# EAGLE schematic Janus (EAGLE 7.3.0)
AUTHOR: Jordan Jones; AUTHOR1: Gabriel Maraboto; DESCRIPT: Single Two Input XOR Single One Input NOT 555 Timer Quad Two Input AND; DEVICE: CAPACITOR CAPACITOR 1N4148X-TP TLP152 TLP152 TLP152 DMN6140L-7 DMN6140L-7 RESISTOR RESISTOR RESISTOR RESISTOR 74LVC1G86W5-7 74HCT1G14GW,125 NE555S-13DICT-ND SN74LV08APWR; DOCNUM: 1; ORGANIZATION: CAL POLY IGVC; PACKAGE: C0603 C0603 SOD523_SC79 SOIC-6-5 SOIC-6-5 SOIC-6-5 SOT-23 SOT-23 R0603 R0603 R0603 R0603 SOT-25 SOT-353 SO-8 TSSOP-14; PARTS: C1 C2 D1 OK1 OK2 OK3 Q1 Q2 R1 R2 R3 R4 U1 U2 U3 U4; PARTVAL: .01uF 100nF 330ohm 330ohm 330ohm 1Mohm; REV: 1.0.1
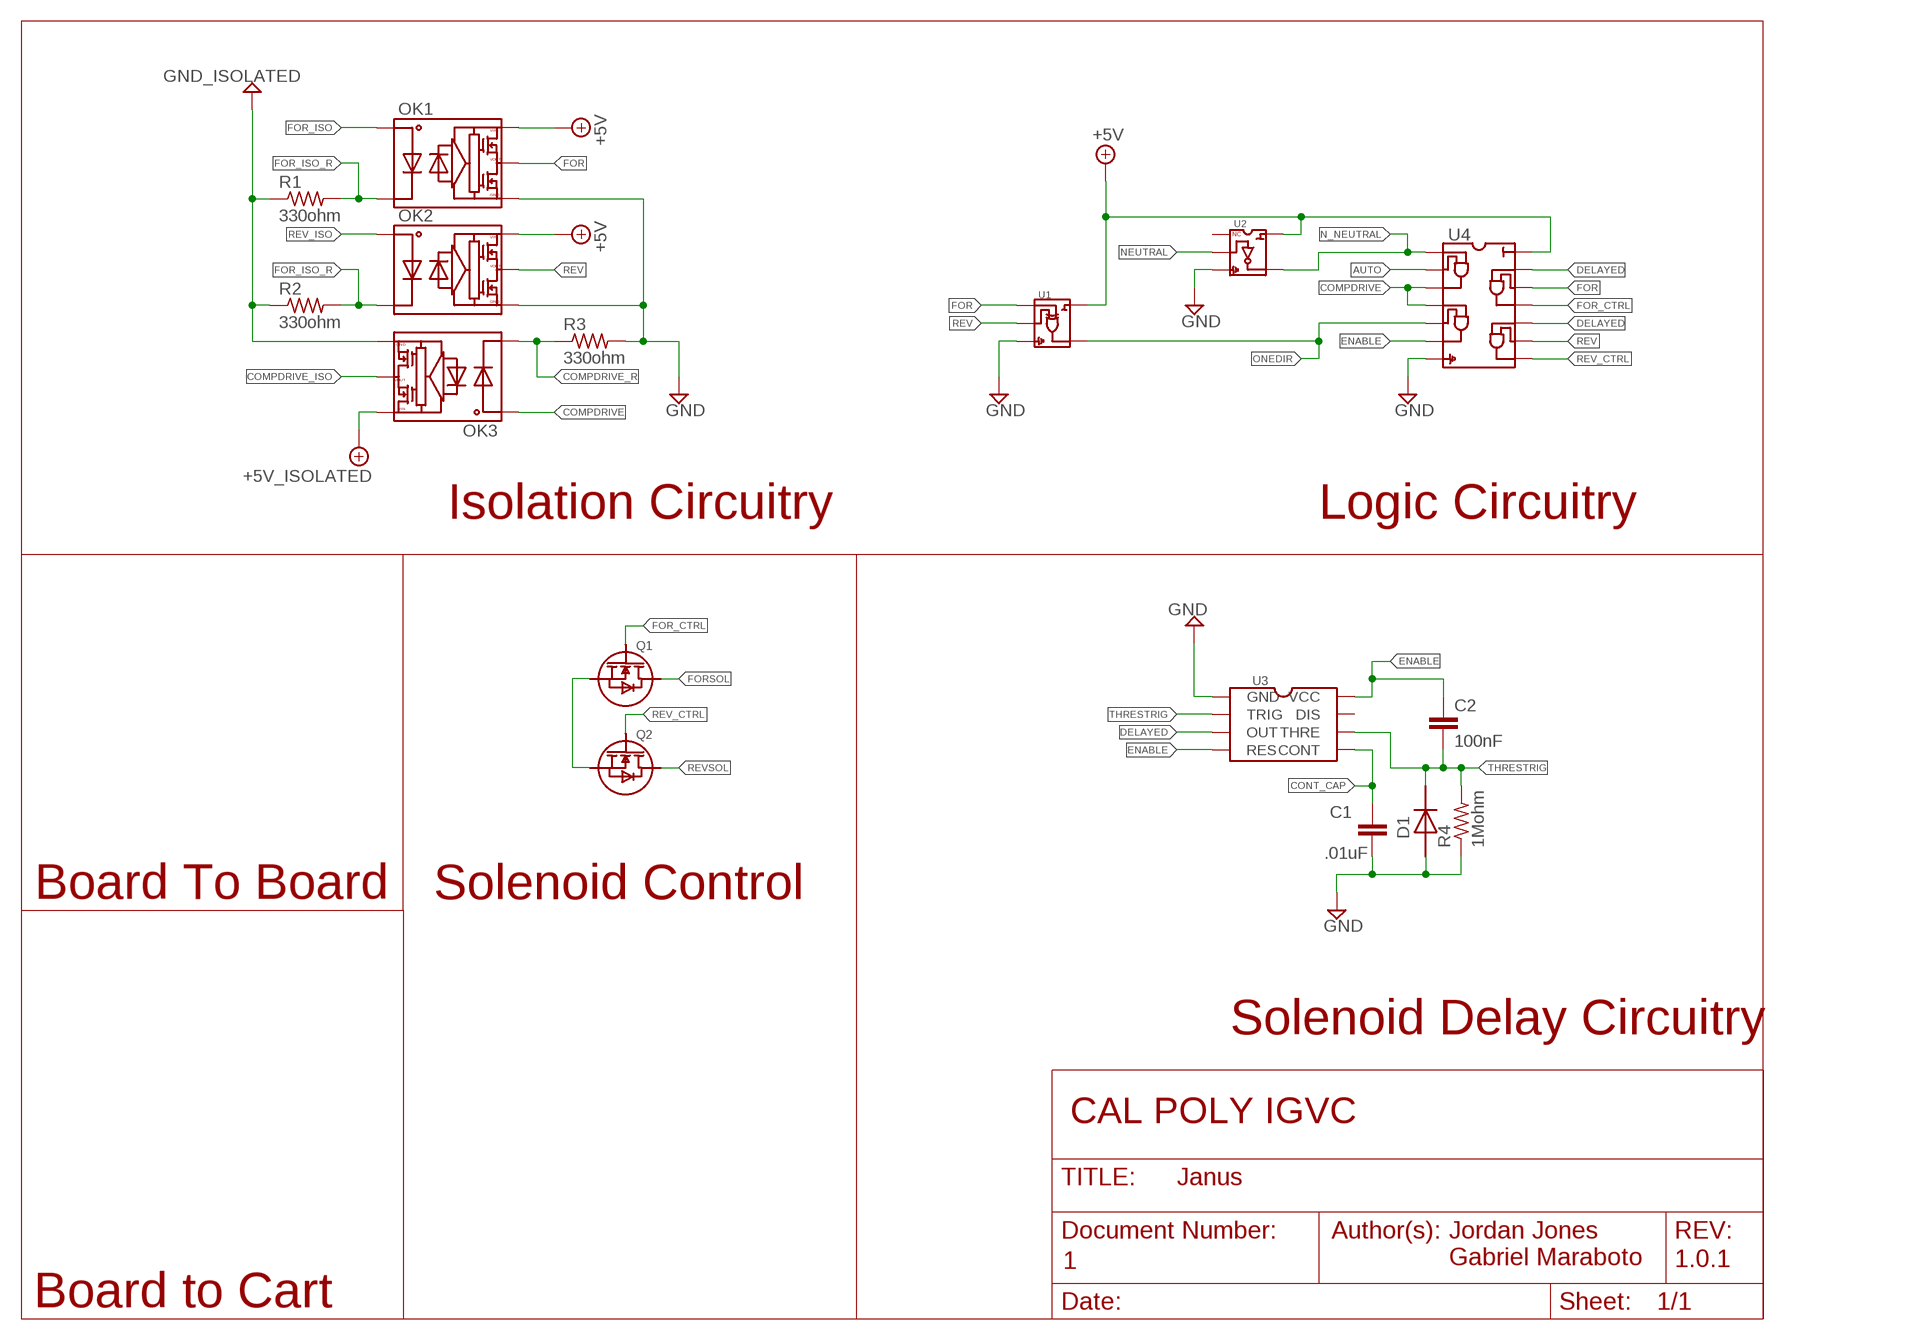
[diagram p0: schematic, sheet 1]

## Parts
C1  .01uF  C-EUC0603  [C0603]
C2  100nF  C-EUC0603  [C0603]
D1  1N4148X-TP  [SOD523_SC79]
OK1  TLP152  [6-SOIC-5]
OK2  TLP152  [6-SOIC-5]
OK3  TLP152  [6-SOIC-5]
Q1  DMN6140L-7  [SOT23]
Q2  DMN6140L-7  [SOT23]
R1  330ohm  R-US_R0603  [R0603]
R2  330ohm  R-US_R0603  [R0603]
R3  330ohm  R-US_R0603  [R0603]
R4  1Mohm  R-US_R0603  [R0603]
U1  74LVC1G86W5-7  [SOT-25]
U2  74HCT1G14GW,125  [SOT-353]
U3  NE555S-13DICT-ND  [SO-8]
U4  SN74LV08APWR  [TSSOP-14]

## Nets
+5V: OK1.P$6 OK2.P$6 OK3.P$6 U1.P$5 U2.P$5 U4.P$14 ; supply symbol labelled +5V_ISOLATED
AUTO: U4.P$2
COMPDRIVE: OK3.P$1 U4.P$3 U4.P$4
COMPDRIVE_ISO: OK3.P$5
COMPDRIVE_R: OK3.P$3 R3.1
CONT_CAP: C1.1 U3.P$5(CONT)
DELAYED: U3.P$3(OUT) U4.P$10 U4.P$13
ENABLE: C2.1 U3.P$4(RES) U3.P$8(VCC) U4.P$6
FOR: OK1.P$5 U1.P$1 U4.P$12
FOR_CTRL: Q1.P$1(G) U4.P$11
FOR_ISO: OK1.P$1
FOR_ISO_R: OK1.P$3 OK2.P$3 R1.2 R2.2
FORSOL: Q1.P$3(D)
GND: C1.2 D1.P$1 OK1.P$4 OK2.P$4 OK3.P$4 R1.1 R2.1 R3.2 R4.1 U1.P$3 U2.P$3 U3.P$1(GND) U4.P$7 ; supply symbol labelled GND_ISOLATED
N$1: Q1.P$2(S) Q2.P$2(S)
N_NEUTRAL: U2.P$4 U4.P$1
NEUTRAL: U2.P$2
ONEDIR: U1.P$4 U4.P$5
REV: OK2.P$5 U1.P$2 U4.P$9
REV_CTRL: Q2.P$1(G) U4.P$8
REV_ISO: OK2.P$1
REVSOL: Q2.P$3(D)
THRESTRIG: C2.2 D1.P$2 R4.2 U3.P$2(TRIG) U3.P$6(THRE)
Unconnected: U2.P$1 U3.P$7(DIS)

## Notes on the sheet
- Isolation Circuitry | Logic Circuitry
- Board To Board | Solenoid Control
- Solenoid Delay Circuitry
- Board to Cart

## Library data of the parts
C1 C2 = resistor:C-EU: CAPACITOR, European symbol
D1 = CP-Discrete:1N4148X-TP
OK1-OK3 = CP-Discrete:TLP152
Q1 Q2 = CP-Discrete:DMN6140L-7
R1-R4 = resistor:R-US_: RESISTOR, American symbol
U1 = CP-IC:74LVC1G86W5-7: Single Two Input XOR
U2 = CP-IC:74HCT1G14GW,125: Single One Input NOT
U3 = CP-IC:NE555S-13DICT-ND: 555 Timer
U4 = CP-IC:SN74LV08APWR: Quad Two Input AND